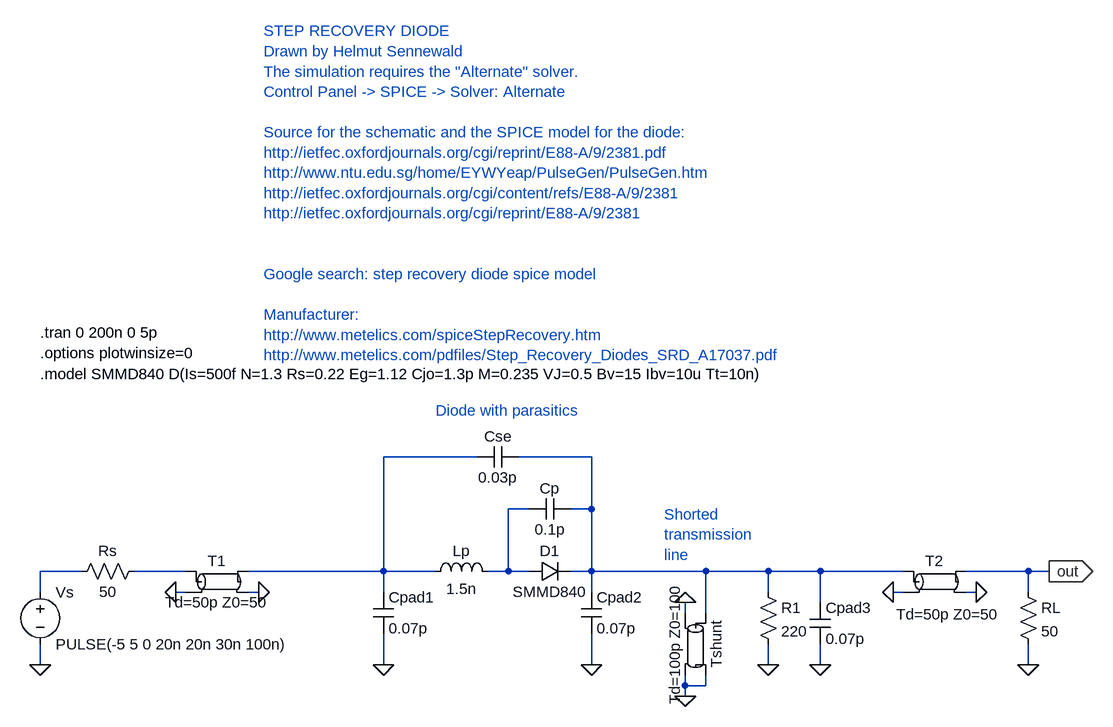
[diagram p0: schematic step_recovery_diode.asc]
step_recovery_diode.asc, the LTspice schematic file:
Version 4
SHEET 1 880 680
WIRE -848 144 -848 112
WIRE -848 256 -848 224
WIRE -784 112 -848 112
WIRE -624 112 -704 112
WIRE -624 144 -640 144
WIRE -512 144 -528 144
WIRE -320 112 -528 112
WIRE -320 112 -320 -64
WIRE -320 144 -320 112
WIRE -320 256 -320 208
WIRE -240 112 -320 112
WIRE -176 -64 -320 -64
WIRE -128 112 -160 112
WIRE -128 112 -128 16
WIRE -96 16 -128 16
WIRE -96 112 -128 112
WIRE 0 -64 -112 -64
WIRE 0 16 -32 16
WIRE 0 16 0 -64
WIRE 0 112 -32 112
WIRE 0 112 0 16
WIRE 0 144 0 112
WIRE 0 256 0 208
WIRE 144 176 144 160
WIRE 144 288 144 272
WIRE 144 304 144 288
WIRE 176 112 0 112
WIRE 176 176 176 112
WIRE 176 288 144 288
WIRE 176 288 176 272
WIRE 272 112 176 112
WIRE 272 144 272 112
WIRE 272 256 272 224
WIRE 352 112 272 112
WIRE 352 160 352 112
WIRE 352 256 352 224
WIRE 480 112 352 112
WIRE 480 144 464 144
WIRE 592 144 576 144
WIRE 672 112 576 112
WIRE 672 144 672 112
WIRE 672 256 672 224
WIRE 704 112 672 112
FLAG 144 304 0
FLAG 144 160 0
FLAG -512 144 0
FLAG -640 144 0
FLAG -320 256 0
FLAG -848 256 0
FLAG 0 256 0
FLAG 464 144 0
FLAG 592 144 0
FLAG 672 256 0
FLAG 272 256 0
FLAG 352 256 0
FLAG 704 112 out
IOPIN 704 112 Out
SYMBOL diode -96 128 R270
WINDOW 0 32 32 VTop 0
WINDOW 3 0 32 VBottom 0
SYMATTR InstName D1
SYMATTR Value SMMD840
SYMBOL ind -256 128 R270
WINDOW 0 32 56 VTop 0
WINDOW 3 5 56 VBottom 0
SYMATTR InstName Lp
SYMATTR Value 1.5n
SYMBOL cap -176 -48 R270
WINDOW 0 32 32 VTop 0
WINDOW 3 0 32 VBottom 0
SYMATTR InstName Cse
SYMATTR Value 0.03p
SYMBOL cap -96 32 R270
WINDOW 0 32 32 VTop 0
WINDOW 3 0 32 VBottom 0
SYMATTR InstName Cp
SYMATTR Value 0.1p
SYMBOL cap -336 144 R0
SYMATTR InstName Cpad1
SYMATTR Value 0.07p
SYMBOL cap -16 144 R0
SYMATTR InstName Cpad2
SYMATTR Value 0.07p
SYMBOL tline -576 128 R0
SYMATTR InstName T1
SYMATTR Value Td=50p Z0=50
SYMBOL tline 160 224 R90
SYMATTR InstName Tshunt
SYMATTR Value Td=100p Z0=100
SYMBOL tline 528 128 R0
WINDOW 3 -59 50 Left 0
SYMATTR InstName T2
SYMATTR Value Td=50p Z0=50
SYMBOL res -800 128 R270
WINDOW 0 32 56 VTop 0
WINDOW 3 0 56 VBottom 0
SYMATTR InstName Rs
SYMATTR Value 50
SYMBOL voltage -848 128 R0
WINDOW 123 0 0 Left 0
WINDOW 39 0 0 Left 0
SYMATTR InstName Vs
SYMATTR Value PULSE(-5 5 0 20n 20n 30n 100n)
SYMBOL res 256 128 R0
SYMATTR InstName R1
SYMATTR Value 220
SYMBOL cap 336 160 R0
SYMATTR InstName Cpad3
SYMATTR Value 0.07p
SYMBOL res 656 128 R0
SYMATTR InstName RL
SYMATTR Value 50
TEXT -848 -192 Left 0 !.model SMMD840 D(Is=500f N=1.3 Rs=0.22 Eg=1.12 Cjo=1.3p M=0.235 VJ=0.5 Bv=15 Ibv=10u Tt=10n)
TEXT -848 -256 Left 0 !.tran 0 200n 0 5p
TEXT -848 -224 Left 0 !.options plotwinsize=0
TEXT -504 -720 Left 0 ;STEP RECOVERY DIODE \nDrawn by Helmut Sennewald\nThe simulation requires the "Alternate" solver.\nControl Panel -> SPICE -> Solver: Alternate\n \nSource for the schematic and the SPICE model for the diode:\nhttp://ietfec.oxfordjournals.org/cgi/reprint/E88-A/9/2381.pdf\nhttp://www.ntu.edu.sg/home/EYWYeap/PulseGen/PulseGen.htm\nhttp://ietfec.oxfordjournals.org/cgi/content/refs/E88-A/9/2381\nhttp://ietfec.oxfordjournals.org/cgi/reprint/E88-A/9/2381\n \n \nGoogle search: step recovery diode spice model\n \nManufacturer: \nhttp://www.metelics.com/spiceStepRecovery.htm\nhttp://www.metelics.com/pdfiles/Step_Recovery_Diodes_SRD_A17037.pdf
TEXT 112 24 Left 0 ;Shorted \ntransmission \nline
TEXT -240 -136 Left 0 ;Diode with parasitics

The netlist it stands for:
* step_recovery_diode.asc
D1 N004 N005 SMMD840
Lp N003 N004 1.5n
Cse N003 N005 0.03p
Cp N004 N005 0.1p
Cpad1 N003 0 0.07p
Cpad2 N005 0 0.07p
T1 N002 0 N003 0 Td=50p Z0=50
Tshunt N005 0 0 0 Td=100p Z0=100
T2 N005 0 out 0 Td=50p Z0=50
Rs N001 N002 50
Vs N001 0 PULSE(-5 5 0 20n 20n 30n 100n)
R1 N005 0 220
Cpad3 N005 0 0.07p
RL out 0 50
.model D D
.lib standard.dio
.model SMMD840 D(Is=500f N=1.3 Rs=0.22 Eg=1.12 Cjo=1.3p M=0.235 VJ=0.5 Bv=15 Ibv=10u Tt=10n)
.tran 0 200n 0 5p
.options plotwinsize=0
* STEP RECOVERY DIODE
* Drawn by Helmut Sennewald
* The simulation requires the "Alternate" solver.
* Control Panel -> SPICE -> Solver: Alternate
* Source for the schematic and the SPICE model for the diode:
* http://ietfec.oxfordjournals.org/cgi/reprint/E88-A/9/2381.pdf
* http://www.ntu.edu.sg/home/EYWYeap/PulseGen/PulseGen.htm
* http://ietfec.oxfordjournals.org/cgi/content/refs/E88-A/9/2381
* http://ietfec.oxfordjournals.org/cgi/reprint/E88-A/9/2381
* Google search: step recovery diode spice model
* Manufacturer:
* http://www.metelics.com/spiceStepRecovery.htm
* http://www.metelics.com/pdfiles/Step_Recovery_Diodes_SRD_A17037.pdf
* Shorted
* transmission
* line
* Diode with parasitics
.backanno
.end